# EAGLE design anookum_control (EAGLE 7.3.0)
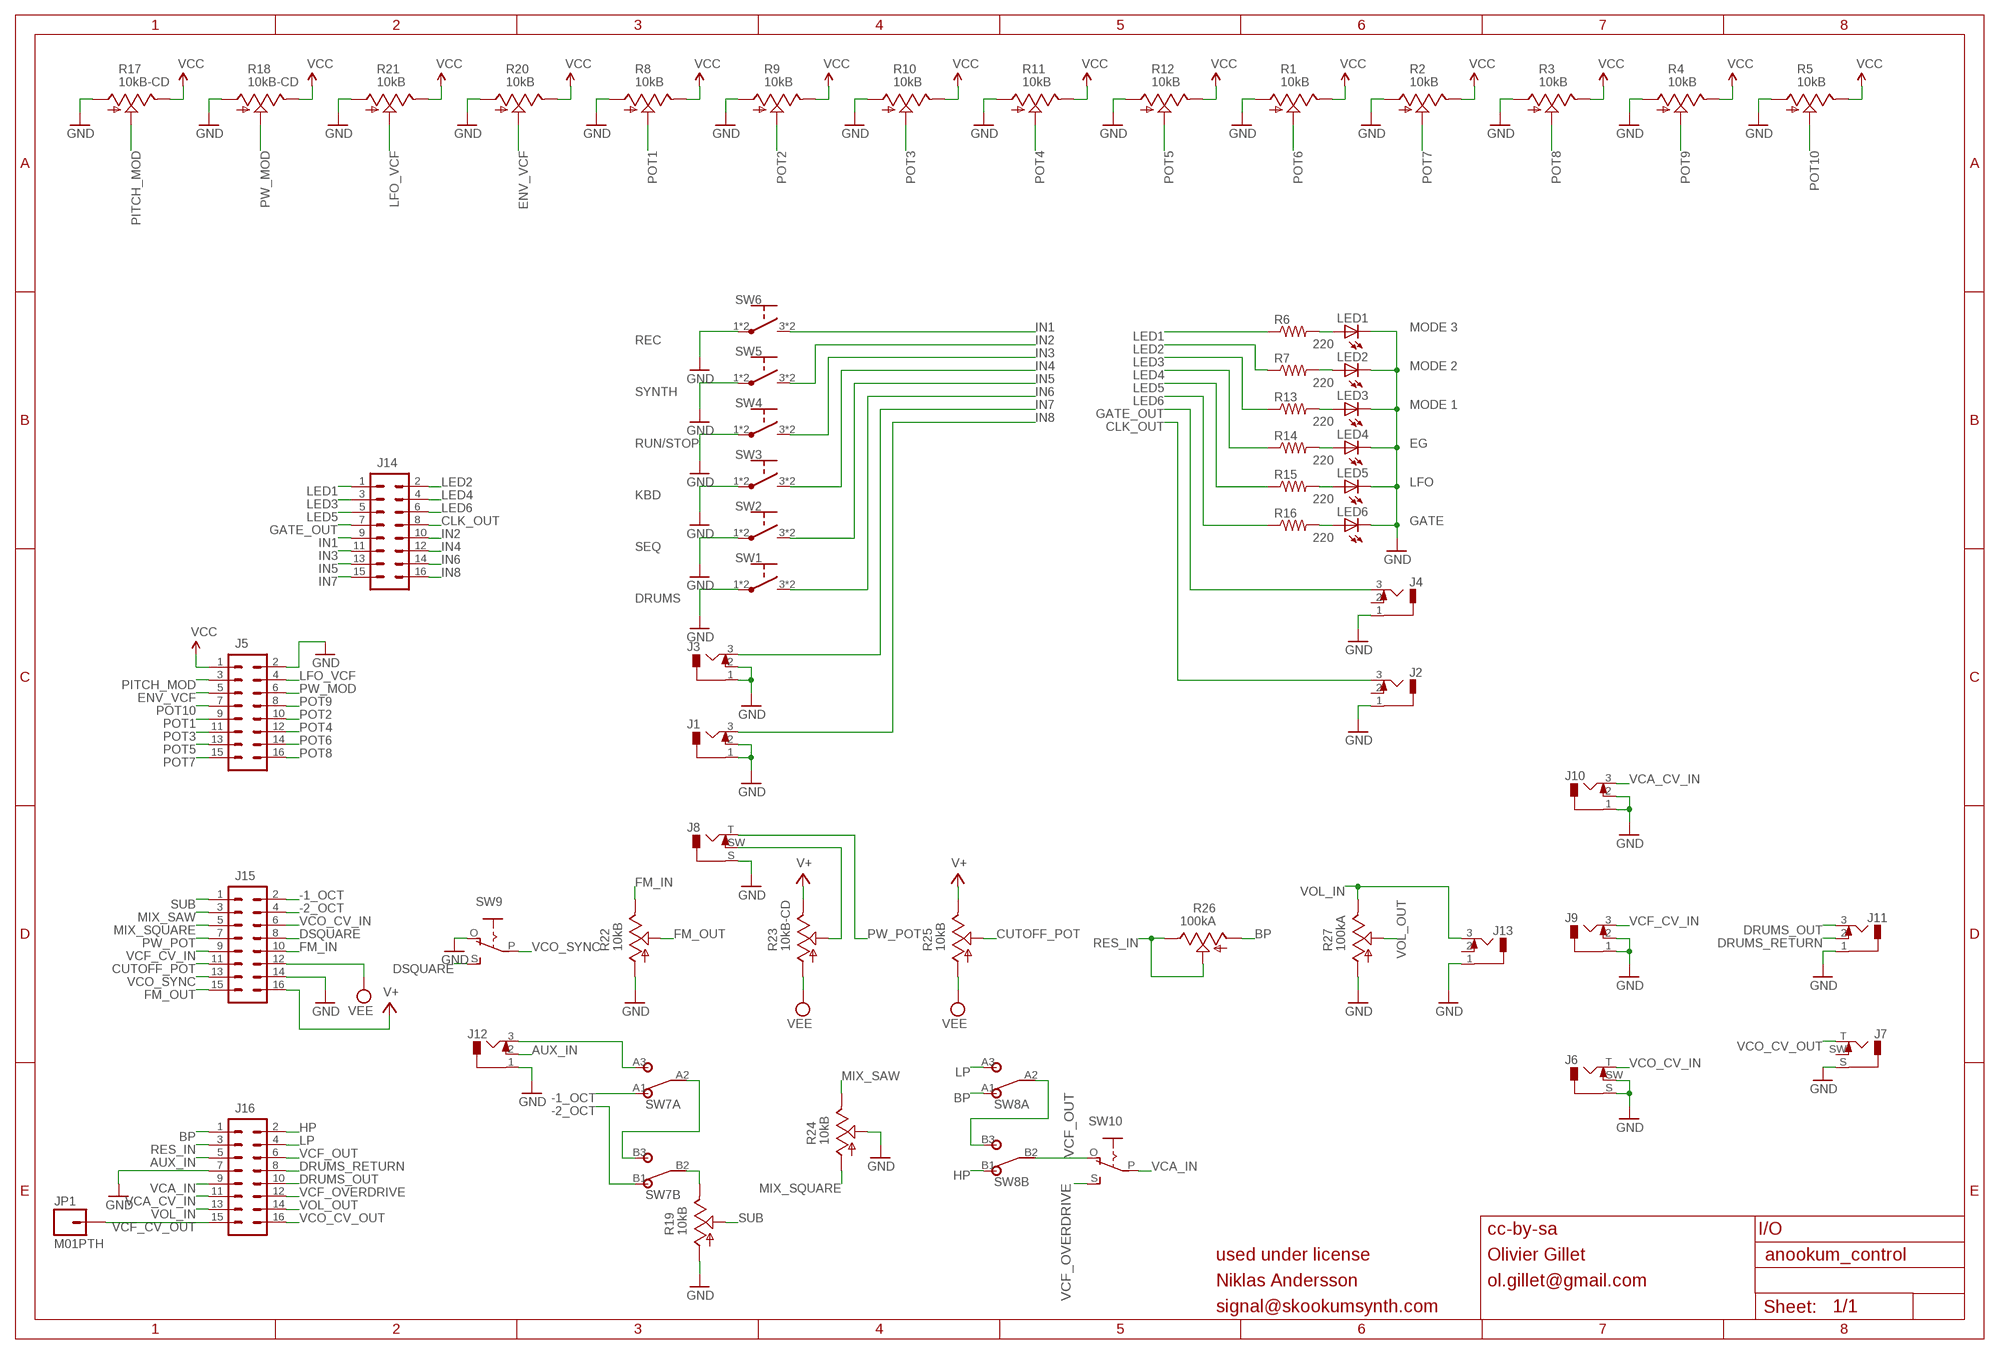
[diagram p0: schematic, sheet 1]

## Parts
J1  JACK_MONO_SW_V  [WQP_PJ301M-12@1]
J2  JACK_MONO_SW_V  [WQP_PJ301M-12@1]
J3  JACK_MONO_SW_V  [WQP_PJ301M-12@1]
J4  JACK_MONO_SW_V  [WQP_PJ301M-12@1]
J5  M08X2  [2X8]
J6  CONN_MONO_SW_F_V  [WQP_PJ301M-12]
J7  CONN_MONO_SW_F_V  [WQP_PJ301M-12]
J8  CONN_MONO_SW_F_V  [WQP_PJ301M-12]
J9  JACK_MONO_SW_V  [WQP_PJ301M-12@1]
J10  JACK_MONO_SW_V  [WQP_PJ301M-12@1]
J11  JACK_MONO_SW_V  [WQP_PJ301M-12@1]
J12  JACK_MONO_SW_V  [WQP_PJ301M-12@1]
J13  JACK_MONO_SW_V  [WQP_PJ301M-12@1]
J14  M08X2  [2X8]
J15  M08X2  [2X8]
J16  M08X2  [2X8]
JP1  M01PTH  [1X01]
LED1  LED3MM  [LED3MM]
LED2  LED3MM  [LED3MM]
LED3  LED3MM  [LED3MM]
LED4  LED3MM  [LED3MM]
LED5  LED3MM  [LED3MM]
LED6  LED3MM  [LED3MM]
R1  10kB  POT_USVERTICAL  [ALPS_POT_VERTICAL]
R2  10kB  POT_USVERTICAL  [ALPS_POT_VERTICAL]
R3  10kB  POT_USVERTICAL  [ALPS_POT_VERTICAL]
R4  10kB  POT_USVERTICAL  [ALPS_POT_VERTICAL]
R5  10kB  POT_USVERTICAL  [ALPS_POT_VERTICAL]
R6  220  R-US_0204/7  [0204/7]
R7  220  R-US_0204/7  [0204/7]
R8  10kB  POT_USVERTICAL  [ALPS_POT_VERTICAL]
R9  10kB  POT_USVERTICAL  [ALPS_POT_VERTICAL]
R10  10kB  POT_USVERTICAL  [ALPS_POT_VERTICAL]
R11  10kB  POT_USVERTICAL  [ALPS_POT_VERTICAL]
R12  10kB  POT_USVERTICAL  [ALPS_POT_VERTICAL]
R13  220  R-US_0204/7  [0204/7]
R14  220  R-US_0204/7  [0204/7]
R15  220  R-US_0204/7  [0204/7]
R16  220  R-US_0204/7  [0204/7]
R17  10kB-CD  POT_USVERTICAL  [ALPS_POT_VERTICAL]
R18  10kB-CD  POT_USVERTICAL  [ALPS_POT_VERTICAL]
R19  10kB  POT_USVERTICAL  [ALPS_POT_VERTICAL]
R20  10kB  POT_USVERTICAL  [ALPS_POT_VERTICAL]
R21  10kB  POT_USVERTICAL  [ALPS_POT_VERTICAL]
R22  10kB  POT_USVERTICAL  [ALPS_POT_VERTICAL]
R23  10kB-CD  POT_USVERTICAL  [ALPS_POT_VERTICAL]
R24  10kB  POT_USVERTICAL  [ALPS_POT_VERTICAL]
R25  10kB  POT_USVERTICAL  [ALPS_POT_VERTICAL]
R26  100kA  POT_USVERTICAL  [ALPS_POT_VERTICAL]
R27  100kA  POT_USVERTICAL  [ALPS_POT_VERTICAL]
SW1  SW_TACTD6  [D6]
SW2  SW_TACTD6  [D6]
SW3  SW_TACTD6  [D6]
SW4  SW_TACTD6  [D6]
SW5  SW_TACTD6  [D6]
SW6  SW_TACTD6  [D6]
SW7  DPDT1AD6T2B4M2RE  [DPDT]
SW8  DPDT1AD6T2B4M2RE  [DPDT]
SW9  EG1218S  [EG1218]
SW10  EG1218S  [EG1218]

## Nets
-1_OCT: J15.2 SW7.A1
-2_OCT: J15.4 SW7.B1
AUX_IN: J12.2(SW) J16.5
BP: J16.1 R26.P$3(A) SW8.A1
CLK_OUT: J2.3(T) J14.8
CUTOFF_POT: J15.11 R25.P$2(S)
DRUMS_OUT: J11.3(T) J16.10
DRUMS_RETURN: J11.2(SW) J16.8
DSQUARE: J15.8 SW9.S
ENV_VCF: J5.5 R20.P$2(S)
FM_IN: J15.10 R22.P$1(E)
FM_OUT: J15.15 R22.P$2(S)
GATE_OUT: J4.3(T) J14.7
GND: J1.1(S) J1.2(SW) J2.1(S) J3.1(S) J3.2(SW) J4.1(S) J5.2 J6.S J6.SW J7.S J8.S J9.1(S) J9.2(SW) J10.1(S) J10.2(SW) J11.1(S) J12.1(S) J13.1(S) J15.14 J16.7 LED1.K(C) LED2.K(C) LED3.K(C) LED4.K(C) LED5.K(C) LED6.K(C) R1.P$3(A) R2.P$3(A) R3.P$3(A) R4.P$3(A) R5.P$3(A) R8.P$3(A) R9.P$3(A) R10.P$3(A) R11.P$3(A) R12.P$3(A) R17.P$3(A) R18.P$3(A) R19.P$3(A) R20.P$3(A) R21.P$3(A) R22.P$3(A) R24.P$2(S) R27.P$3(A) SW1.1 SW1.2 SW2.1 SW2.2 SW3.1 SW3.2 SW4.1 SW4.2 SW5.1 SW5.2 SW6.1 SW6.2 SW9.O
HP: J16.2 SW8.B1
IN1: J14.9 SW6.3 SW6.4
IN2: J14.10 SW5.3 SW5.4
IN3: J14.11 SW4.3 SW4.4
IN4: J14.12 SW3.3 SW3.4
IN5: J14.13 SW2.3 SW2.4
IN6: J14.14 SW1.3 SW1.4
IN7: J3.3(T) J14.15
IN8: J1.3(T) J14.16
LED1: J14.1 R6.1
LED2: J14.2 R7.1
LED3: J14.3 R13.1
LED4: J14.4 R14.1
LED5: J14.5 R15.1
LED6: J14.6 R16.1
LFO_VCF: J5.4 R21.P$2(S)
LP: J16.4 SW8.A3
MIX_SAW: J15.3 R24.P$1(E)
MIX_SQUARE: J15.5 R24.P$3(A)
N$1: J8.SW R23.P$2(S)
N$2: R19.P$1(E) SW7.B2
N$10: J12.3(T) SW7.A3
N$36: SW8.A2 SW8.B3
N$42: LED1.A R6.2
N$43: LED2.A R7.2
N$44: LED3.A R13.2
N$45: LED4.A R14.2
N$46: LED5.A R15.2
N$47: LED6.A R16.2
N$65: SW7.A2 SW7.B3
PITCH_MOD: J5.3 R17.P$2(S)
POT1: J5.9 R8.P$2(S)
POT2: J5.10 R9.P$2(S)
POT3: J5.11 R10.P$2(S)
POT4: J5.12 R11.P$2(S)
POT5: J5.13 R12.P$2(S)
POT6: J5.14 R1.P$2(S)
POT7: J5.15 R2.P$2(S)
POT8: J5.16 R3.P$2(S)
POT9: J5.8 R4.P$2(S)
POT10: J5.7 R5.P$2(S)
PW_MOD: J5.6 R18.P$2(S)
PW_POT: J8.T J15.7
RES_IN: J16.3 R26.P$1(E) R26.P$2(S)
SUB: J15.1 R19.P$2(S)
V+: J15.16 R23.P$1(E) R25.P$1(E)
VCA_CV_IN: J10.3(T) J16.11
VCA_IN: J16.9 SW10.P
VCC: J5.1 R1.P$1(E) R2.P$1(E) R3.P$1(E) R4.P$1(E) R5.P$1(E) R8.P$1(E) R9.P$1(E) R10.P$1(E) R11.P$1(E) R12.P$1(E) R17.P$1(E) R18.P$1(E) R20.P$1(E) R21.P$1(E)
VCF_CV_IN: J9.3(T) J15.9
VCF_CV_OUT: J16.15 JP1.1
VCF_OUT: J16.6 SW8.B2 SW10.O
VCF_OVERDRIVE: J16.12 SW10.S
VCO_CV_IN: J6.T J15.6
VCO_CV_OUT: J7.T J16.16
VCO_SYNC: J15.13 SW9.P
VEE: J15.12 R23.P$3(A) R25.P$3(A)
VOL_IN: J13.3(T) J16.13 R27.P$1(E)
VOL_OUT: J16.14 R27.P$2(S)
Unconnected: J2.2(SW) J4.2(SW) J7.SW J13.2(SW)

## Notes on the sheet
- MODE 3
- REC
- MODE 2
- SYNTH
- MODE 1
- RUN/STOP | EG
- LFO
- KBD
- GATE
- SEQ
- DRUMS
- cc-by-sa | I/O
- used under license | Olivier Gillet
- Niklas Andersson | ol.gillet@gmail.com
- signal@skookumsynth.com

## Library data of the parts
J1-J4 J9-J13 = 000:JACK_MONO_SW: 3.5mm mono switched jacks WQP-PJ301M-12 - Available at: http://erthenvar.com and http://www.thonk.co.uk/
J5 J14-J16 = SparkFun:M08X2
J6-J8 = 000:CONN_MONO_SW_F: 3.5mm mono switched jacks WQP-PJ301M-12 - Available at: http://erthenvar.com and http://www.thonk.co.uk/
JP1 = SparkFun:M01: Header 1 Standard 1-pin 0.1" header. Use with straight break away headers (SKU : PRT-00116), right angle break away headers (PRT-00553), swiss pins (PRT-00743), machine pins (PRT-00117), and female headers (PRT-00115).
LED1-LED6 = led:LED: LED OSRAM: - CHIPLED LG R971, LG N971, LY N971, LG Q971, LY Q971, LO R971, LY R971 LH N974, LH R974 LS Q976, LO Q976, LY Q976 LO Q996 - Hyper CHIPLED LW Q18S LB Q993, LB Q99A, LB R99A - SideLED LS A670, LO A670, LY A670, LG A670, LP A670 LB A673, LV A673, LT A673, LW A673 LH A674 LY A675 LS A676, LA A676, LO A676, LY A676, LW A676 LS A679, LY A679, LG A679 - Hyper Micro SIDELED® LS Y876, LA Y876, LO Y876, LY Y876 LT Y87S - SmartLED LW L88C, LW L88S LB L89C, LB L89S, LG L890 LS L89K, LO L89K, LY L89K LS L896, LA L896, LO L896, LY L896 - TOPLED LS T670, LO T670, LY T670, LG T670, LP T670 LSG T670, LSP T670, LSY T670, LOP T670, LYG T670 LG T671, LOG T671, LSG T671 LB T673, LV T673, LT T673, LW T673 LH T674 LS T676, LA T676, LO T676, LY T676, LB T676, LH T676, LSB T676, LW T676 LB T67C, LV T67C, LT T67C, LS T67K, LO T67K, LY T67K, LW E67C LS E67B, LA E67B, LO E67B, LY E67B, LB E67C, LV E67C, LT E67C LW T67C LS T679, LY T679, LG T679 LS T770, LO T770, LY T770, LG T770, LP T770 LB T773, LV T773, LT T773, LW T773 LH T774 LS E675, LA E675, LY E675, LS T675 LS T776, LA T776, LO T776, LY T776, LB T776 LHGB T686 LT T68C, LB T68C - Hyper Mini TOPLED® LB M676 - Mini TOPLED Santana® LG M470 LS M47K, LO M47K, LY M47K Source: http://www.osram.convergy.de LUXEON: - LUMILED® LXK2-PW12-R00, LXK2-PW12-S00, LXK2-PW14-U00, LXK2-PW14-V00 LXK2-PM12-R00, LXK2-PM12-S00, LXK2-PM14-U00 LXK2-PE12-Q00, LXK2-PE12-R00, LXK2-PE12-S00, LXK2-PE14-T00, LXK2-PE14-U00 LXK2-PB12-K00, LXK2-PB12-L00, LXK2-PB12-M00, LXK2-PB14-N00, LXK2-PB14-P00, LXK2-PB14-Q00 LXK2-PR12-L00, LXK2-PR12-M00, LXK2-PR14-Q00, LXK2-PR14-R00 LXK2-PD12-Q00, LXK2-PD12-R00, LXK2-PD12-S00 LXK2-PH12-R00, LXK2-PH12-S00 LXK2-PL12-P00, LXK2-PL12-Q00, LXK2-PL12-R00 Source: www.luxeon.com KINGBRIGHT: KA-3528ASYC Source: www.kingbright.com
R1-R5 R8-R12 R17-R27 = pot-alps:POT_US
R6 R7 R13-R16 = rcl:R-US_: RESISTOR, American symbol
SW1-SW6 = 000:SW_TACT
SW7 SW8 = Anu-Control-revC:DPDT
SW9 SW10 = Anu-Control-revC:EG1218: SLIDING SWITCH 0.1" spacing through hole, vertical SPDT slide switch http://www.ladyada.net/library/pcb/eaglelibrary.html

## Board
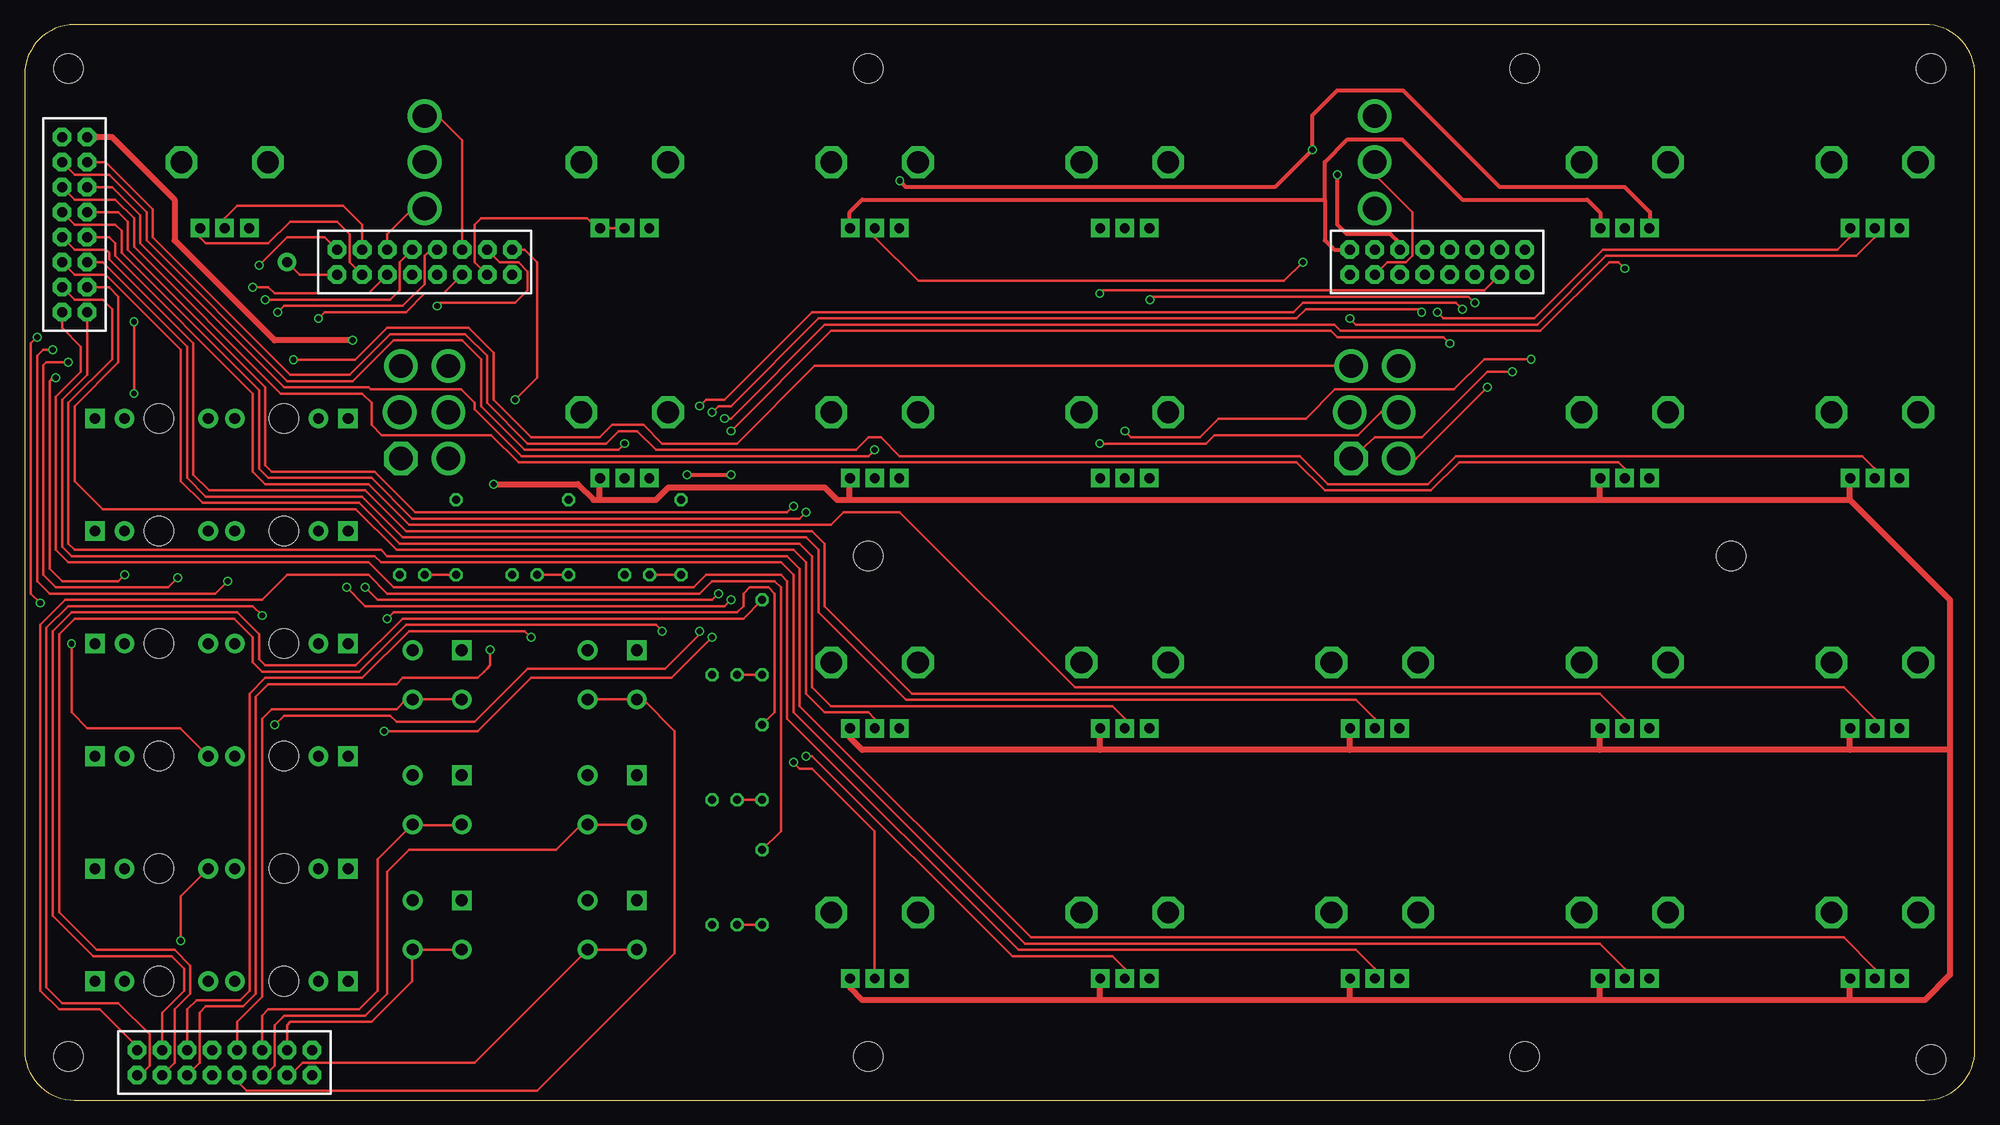
[diagram p1: board, top side]
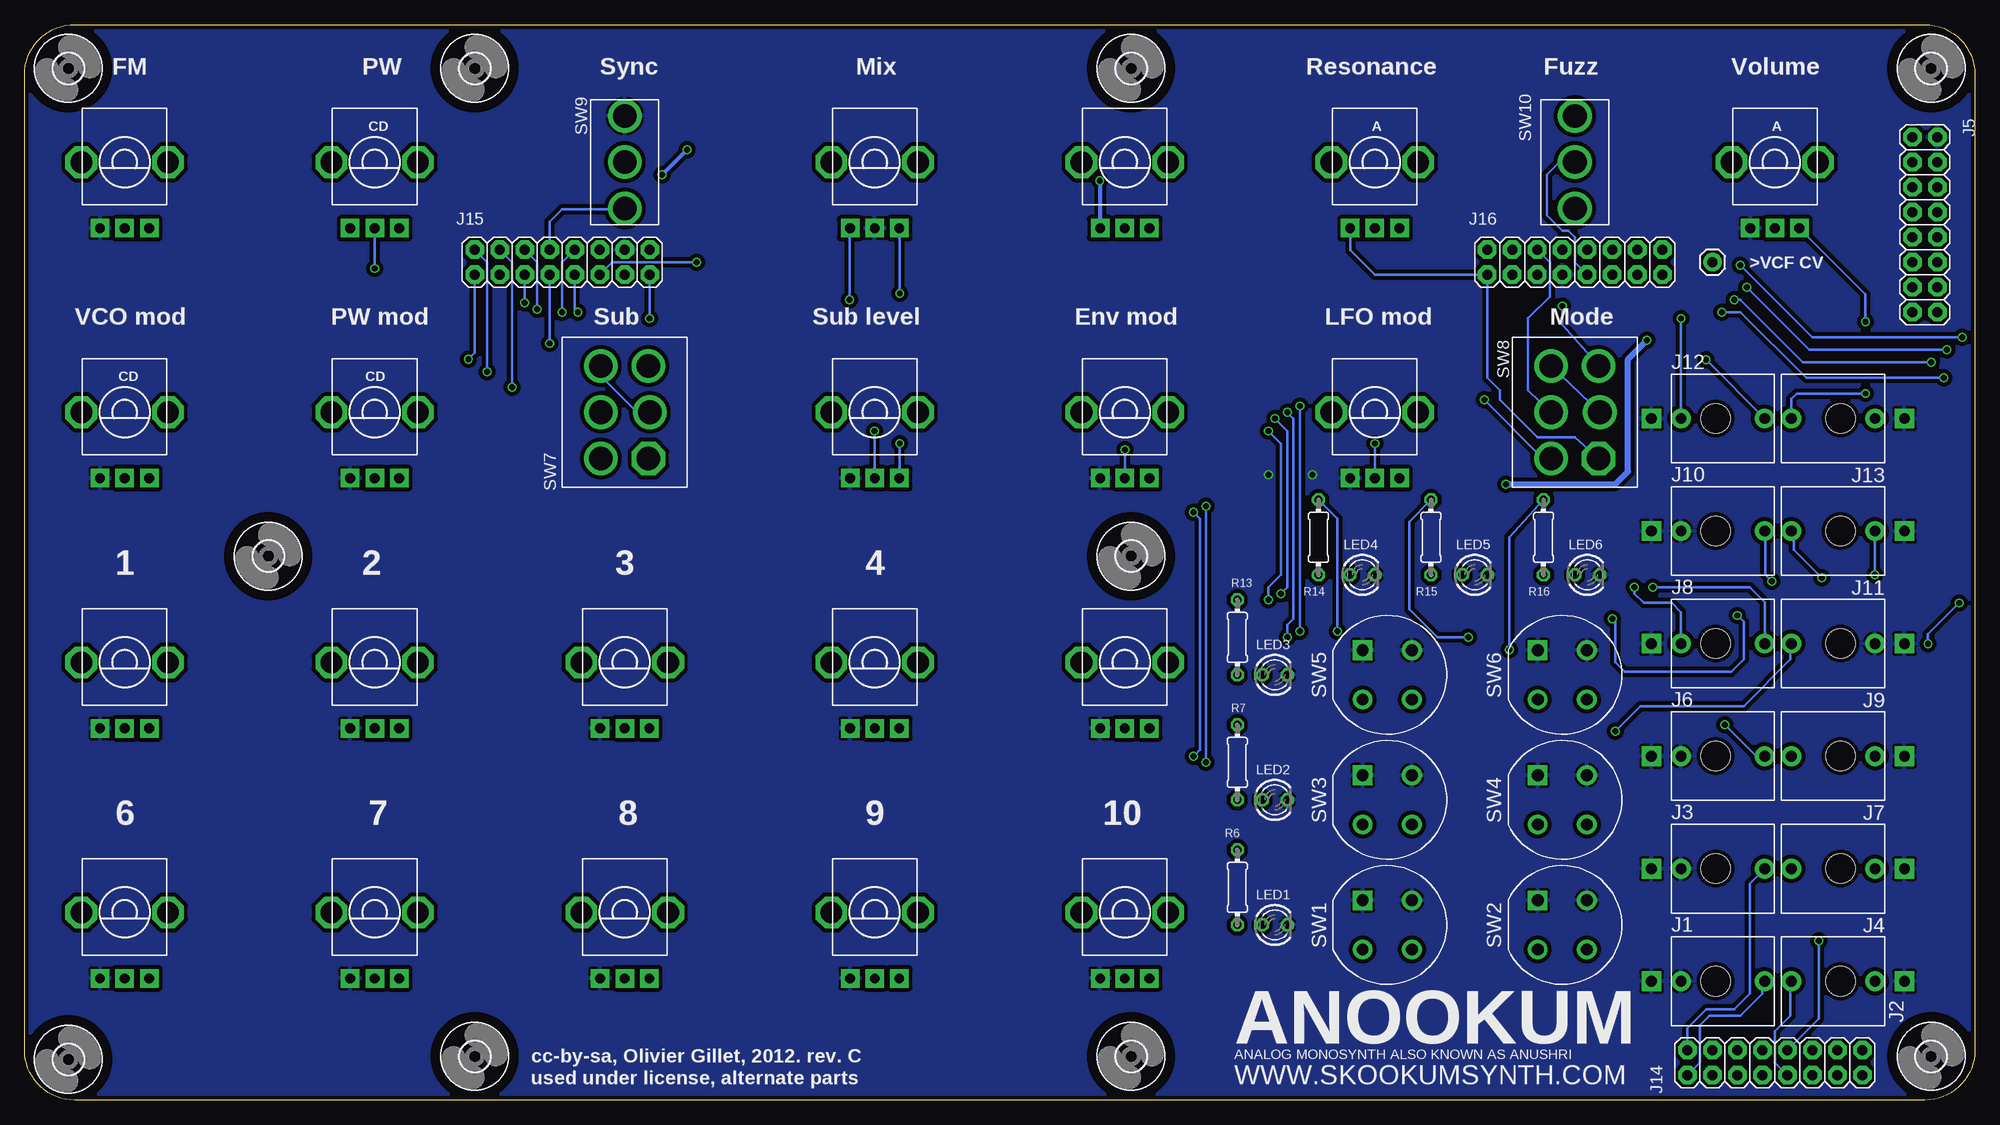
[diagram p2: board, bottom side, seen from below]

Size 198.12 x 109.22 mm. Coordinates in mm from the lower left corner, seen from the top.
Outline: 5.08,109.22 arc90 0,104.14 0,5.08 arc90 5.08,0 193.04,0 arc90 198.12,5.08 198.12,104.14 arc90 193.04,109.22 5.08,109.22
Copper layers (1*16): Top 0.035mm / dielectric 1.5mm / Bottom 0.035mm
Design rules "dirt_cheap_dirty_boards.v1": minimum track width 5mil, minimum drill 12mil, track to track 5mil, track to pad 5mil, pad to pad 5mil, via to via 5mil, smd to smd 0mil, copper to edge 10mil, drill to drill 10mil, minimum pad ring 10mil, minimum via ring 6mil, stop-mask expansion 2mil, vias tented up to drill 25mil, thermal gap 10mil

### Footprints (pad centres in the part's own frame; a part is rotated, then mirrored left to right if it is on the bottom)
WQP_PJ301M-12@1 = drill 1.1 pad 2 square: 1 0,-6.5 | drill 1.1 pad 2: 2 0,-3.5; 3 0,5 | hole 3: 0,0
2X8 = drill 1.016 pad 1.88 octagon: 1 0,0; 2 0,2.54; 3 2.54,0; 4 2.54,2.54; 5 5.08,0; 6 5.08,2.54; 7 7.62,0; 8 7.62,2.54; 9 10.16,0; 10 10.16,2.54; 11 12.7,0; 12 12.7,2.54; 13 15.24,0; 14 15.24,2.54; 15 17.78,0; 16 17.78,2.54
WQP_PJ301M-12 = drill 1.1 pad 2 square: S 0,-6.5 | drill 1.1 pad 2: SW 0,-3.5; T 0,5 | hole 3: 0,0
1X01 = drill 1.016 pad 1.88: 1 0,0
LED3MM = drill 0.813 octagon: A -1.27,0; K 1.27,0
ALPS_POT_VERTICAL = drill 1 pad 1.88 square: P$1 -2.5,6.7; P$2 0,6.7; P$3 2.5,6.7 | drill 2.2 pad 3.175 octagon: P$4 -4.4,0; P$5 4.4,0
0204/7 = drill 0.813 octagon: 1 -3.81,0; 2 3.81,0
D6 = drill 1.2 pad 2 square: 1 -2.5,2.5 | drill 1.2 pad 2: 2 2.5,2.5; 3 -2.5,-2.5; 4 2.5,-2.5
DPDT = drill 2.4 octagon: A1 -2.415,4.7 | drill 2.4: A2 -2.54,0; A3 -2.415,-4.7; B1 2.415,4.7; B2 2.415,0; B3 2.415,-4.7
EG1218 = drill 2.4: O -4.7,0; P 0,0; S 4.7,0
3,0 = hole 3: 0,0

### Placement (x,y rotation side)
J1  26.35,12.06 270 bottom
J2  13.65,12.06 90 bottom
J3  26.35,23.5 270 bottom
J4  13.65,23.5 90 bottom
J5  6.35,97.79 270 bottom
J6  26.35,34.92 270 bottom
J7  13.65,34.92 90 bottom
J8  26.35,46.35 270 bottom
J9  13.65,46.35 90 bottom
J10  26.35,57.78 270 bottom
J11  13.65,57.78 90 bottom
J12  26.35,69.22 270 bottom
J13  13.65,69.22 90 bottom
J14  11.43,5.08 180 bottom
J15  152.4,83.82 0 bottom
J16  49.53,83.82 0 bottom
JP1  26.67,85.09 0 bottom
LED1  71.12,17.78 0 bottom
LED2  71.12,30.48 0 bottom
LED3  71.12,43.18 0 bottom
LED4  62.23,53.34 0 bottom
LED5  50.8,53.34 0 bottom
LED6  39.37,53.34 0 bottom
R1  187.96,19.05 180 bottom
R2  162.56,19.05 180 bottom
R3  137.16,19.05 180 bottom
R4  111.76,19.05 180 bottom
R5  86.36,19.05 180 bottom
R6  74.93,21.59 270 bottom
R7  74.93,34.29 270 bottom
R8  187.96,44.45 180 bottom
R9  162.56,44.45 180 bottom
R10  137.16,44.45 180 bottom
R11  111.76,44.45 180 bottom
R12  86.36,44.45 180 bottom
R13  74.93,46.99 270 bottom
R14  66.67,57.15 270 bottom
R15  55.24,57.15 270 bottom
R16  43.81,57.15 270 bottom
R17  187.96,69.85 180 bottom
R18  162.56,69.85 180 bottom
R19  111.76,69.85 180 bottom
R20  86.36,69.85 180 bottom
R21  60.96,69.85 180 bottom
R22  187.96,95.25 180 bottom
R23  162.56,95.25 180 bottom
R24  111.76,95.25 180 bottom
R25  86.36,95.25 180 bottom
R26  60.96,95.25 180 bottom
R27  20.32,95.25 180 bottom
SW1  59.69,17.78 0 bottom
SW2  41.91,17.78 0 bottom
SW3  59.69,30.48 0 bottom
SW4  41.91,30.48 0 bottom
SW5  59.69,43.18 0 bottom
SW6  41.91,43.18 0 bottom
SW7  137.16,69.85 180 bottom
SW8  40.64,69.85 180 bottom
SW9  137.16,95.25 270 bottom
SW10  40.64,95.25 270 bottom
U$1  [3,0]  193.68,4.13 0 bottom
U$2  [3,0]  152.4,4.45 0 bottom
U$3  [3,0]  85.72,4.45 0 bottom
U$4  [3,0]  4.45,4.45 0 bottom
U$6  [3,0]  173.35,55.24 0 bottom
U$7  [3,0]  85.72,55.24 0 bottom
U$8  [3,0]  193.68,104.78 0 bottom
U$9  [3,0]  152.4,104.78 0 bottom
U$10  [3,0]  85.72,104.78 0 bottom
U$11  [3,0]  4.45,104.78 0 bottom

### Tracks (layer width: path | path; a pad name or v marks a point on that pad's centre or on a via)
-1_OCT  (via drill 0.6)
  Top 0.254: v151.13,73.98 148.59,73.98 141.92,67.31 137.16,67.31 SW7.A1
  Bottom 0.254: v151.13,73.98 151.13,85.09 J15.2
-2_OCT  (via drill 0.6)
  Top 0.254: v148.59,72.39 141.35,65.15 SW7.B1
  Bottom 0.254: v148.59,72.39 148.59,85.09 J15.4
AUX_IN  (via drill 0.6)
  Top 0.254: v29.84,79.38 30.48,80.01 38.73,80.01 40.64,81.92 42.55,81.92 J16.5
  Bottom 0.254: J12.2 29.85,79.37 v29.84,79.38
BP
  Bottom 0.254: R26.P$3 63.46,86.32 60.96,83.82 J16.1 49.53,73.34 48.26,72.07 48.26,71.12 44.45,67.31 40.64,67.31 SW8.A1
CLK_OUT
  Bottom 0.254: J14.8 20.32,3.81 20.32,6.99 18.73,8.57 18.73,11.98 J2.3
CUTOFF_POT  (via drill 0.6)
  Top 0.254: R25.P$2 86.36,87.63 90.81,83.19 127.95,83.19 v129.86,85.09
  Bottom 0.254: v129.86,85.09 138.43,85.09 J15.11
DRUMS_OUT  (via drill 0.6)
  Top 0.254: J16.10 38.1,85.09 38.1,82.23 37.15,81.28 v24.45,81.28 | v15.56,53.02 14.61,52.07 3.17,52.07 1.91,53.34 1.91,74.61 2.22,74.93 v4.45,74.93
  Bottom 0.254: v15.56,53.02 18.41,55.88 18.41,57.55 J11.3 | v4.45,74.93 17.46,74.93 23.81,81.28 v24.45,81.28
DRUMS_RETURN  (via drill 0.6)
  Top 0.254: v10.16,53.34 9.53,52.7 3.81,52.7 2.54,53.98 2.54,73.03 2.86,73.34 v3.17,73.34 | J16.8 41.91,87 40.64,85.72 40.64,82.87 38.42,80.64 26.35,80.64 v25.72,80.01
  Bottom 0.254: J11.2 v10.15,53.35 v10.16,53.34 | v3.17,73.34 17.14,73.34 23.81,80.01 v25.72,80.01
DSQUARE
  Bottom 0.254: J15.8 144.78,89.22 143.51,90.49 137.22,90.49 SW9.S
ENV_VCF  (via drill 0.6)
  Top 0.254: v86.36,66.04 85.72,65.41 50.48,65.41 45.72,70.17 45.72,70.8 44.35,72.17 35.14,72.17 34.92,72.39 26.35,72.39 11.75,87 11.75,89.85 8.89,92.71 J5.5
  Bottom 0.254: v86.36,66.04 R20.P$2
FM_IN  (via drill 0.6)
  Top 0.254: R22.P$1 185.42,88.51 185.42,87.63 184.15,86.36 160.34,86.36 153.35,79.38 144.15,79.38 v143.51,80.01
  Bottom 0.254: v143.51,80.01 143.51,85.09 J15.10
FM_OUT  (via drill 0.6)
  Top 0.254: R22.P$2 187.96,87.63 186.06,85.72 160.66,85.72 153.67,78.74 135.25,78.74 v134.62,79.38
  Bottom 0.254: v134.62,79.38 J15.15
GATE_OUT  (via drill 0.6)
  Top 0.254: v15.88,16.19 15.88,20.72 J4.3
  Bottom 0.254: J14.7 15.88,8.26 v15.88,16.19
GND  (via drill 0.6)
  Top 0.406: v67.31,63.5 v71.75,63.5
  pour Bottom (isolate 0.406): 193.04,0 arc90 198.12,5.08 198.12,104.14 arc90 193.04,109.22 5.08,109.22 arc90 0,104.14 0,5.08 arc90 5.08,0
HP  (via drill 0.6)
  Top 0.254: J16.2 50.8,86.36 52.07,85.09 52.07,73.34 v49.85,71.12
  Bottom 0.254: SW8.B1 43.81,65.09 v49.85,71.12
IN1
  Top 0.254: J14.9 21.59,7.94 24.13,10.48 24.13,38.73 25.08,39.69 37.78,39.69 38.77,40.68 SW6.4 SW6.3
IN2
  Top 0.254: J14.10 21.59,1.91 22.54,0.95 52.07,0.95 66.04,14.92 66.04,37.47 62.87,40.64 62.23,40.64 SW5.3 SW5.4 62.14,40.68
  Bottom 0.254: 62.14,40.68 SW5.3
IN3
  Top 0.254: J14.11 24.13,8.57 24.77,9.21 33.97,9.21 35.88,11.11 35.88,24.45 39.37,27.94 39.37,27.89 | 39.37,27.89 SW4.4 | 39.37,27.89 43.81,27.89 SW4.3
IN4
  Top 0.254: J14.12 24.45,2.54 25.4,3.49 25.4,7.62 26.19,8.41 26.35,8.57 34.61,8.57 36.83,10.79 36.83,23.18 39.05,25.4 53.98,25.4 56.55,27.98 SW3.4 SW3.3
IN5
  Top 0.254: J14.13 26.67,7.62 26.99,7.94 35.24,7.94 39.37,12.06 39.37,15.24 SW2.4 SW2.3
IN6
  Top 0.254: 26.67,2.22 J14.14 26.99,2.54 28.26,3.81 45.72,3.81 SW1.4 SW1.3
IN7
  Bottom 0.254: J14.15 29.21,7.3 27.3,9.21 24.45,9.21 22.86,10.79 22.86,21.99 J3.3
IN8
  Bottom 0.254: J14.16 27.94,3.81 27.94,7.62 26.99,8.57 23.81,8.57 21.59,10.79 21.59,11.83 J1.3
LED1
  Top 0.254: R6.1 76.83,27.3 76.83,52.07 76.2,52.7 69.85,52.7 68.58,51.44 36.83,51.44 34.92,53.34 26.67,53.34 24.13,50.8 4.13,50.8 1.59,48.26 1.59,11.11 3.49,9.21 7.62,9.21 11.11,5.71 11.11,5.4 J14.1
LED2  (via drill 0.6)
  Top 0.254: R7.1 76.2,39.37 76.2,51.44 75.56,52.07 73.66,52.07 73.03,51.44 73.03,50.16 72.39,49.53 37.47,49.53 v36.83,48.9 | J14.2 11.75,2.54 12.7,3.49 12.7,6.67 9.53,9.84 3.81,9.84 2.22,11.43 2.22,47.94 4.45,50.16 23.18,50.16 v24.13,49.21
  Bottom 0.254: v24.13,49.21 23.5,48.58 23.5,44.77 24.77,43.5 35.56,43.5 36.51,44.45 36.51,48.58 v36.83,48.9
LED3
  Top 0.254: R13.1 73.03,48.9 38.42,48.9 33.66,44.13 24.45,44.13 23.81,44.77 23.81,47.31 21.59,49.53 4.76,49.53 2.86,47.62 2.86,18.73 6.99,14.61 14.92,14.61 16.19,13.34 16.19,11.11 13.97,8.89 J14.3
LED4  (via drill 0.6)
  Top 0.254: v64.77,47.62 64.14,48.26 38.73,48.26 33.97,43.5 24.13,43.5 23.18,44.45 23.18,46.99 21.27,48.9 5.08,48.9 3.49,47.31 3.49,19.05 7.3,15.24 15.24,15.24 16.83,13.65 16.83,10.79 15.24,9.21 15.24,3.81 J14.4
  Bottom 0.254: v64.77,47.62 64.77,59.05 R14.1
LED5  (via drill 0.6)
  Top 0.254: v51.44,46.99 50.8,47.62 39.05,47.62 34.29,42.86 24.45,42.86 22.86,41.27 22.86,11.11 21.91,10.16 17.46,10.16 16.51,9.21 J14.5
  Bottom 0.254: R15.1 57.47,58.74 57.47,49.85 54.61,46.99 v51.44,46.99
LED6  (via drill 0.6)
  Top 0.254: J14.6 17.78,3.81 17.78,8.89 18.41,9.53 22.23,9.53 23.5,10.79 23.5,40.96 24.77,42.23 37.78,42.23 38.42,42.86 46.04,42.86 46.67,43.5 46.99,43.81 47.31,44.13 v47.31,45.72
  Bottom 0.254: v47.31,45.72 47.31,57.15 R16.1
LFO_VCF  (via drill 0.6)
  Top 0.254: v60.96,66.67 60.33,66.04 50.8,66.04 46.35,70.48 46.35,75.25 44.45,77.15 37.47,77.15 33.34,73.03 26.67,73.03 12.38,87.31 12.38,90.17 8.57,93.98 5.08,93.98 J5.4
  Bottom 0.254: v60.96,66.67 R21.P$2
LP  (via drill 0.6)
  Top 0.254: J16.4 48.26,85.09 50.16,85.09 51.12,84.14 51.12,82.23 49.85,80.96 42.23,80.96 v41.91,80.64
  Bottom 0.254: SW8.A3 41.91,78.74 v41.91,80.64
MIX_SAW  (via drill 0.6)
  Top 0.254: v109.22,81.92 109.54,82.23 148.27,82.23 J15.3
  Bottom 0.254: R24.P$1 109.22,88.51 v109.22,81.92
MIX_SQUARE  (via drill 0.6)
  Top 0.254: v114.3,81.28 114.62,81.6 146.69,81.6 v147.32,80.96
  Bottom 0.254: R24.P$3 114.3,88.51 v114.3,81.28 | v147.32,80.96 J15.5
N$1  (via drill 0.6)
  Top 0.254: v34.61,52.07 35.88,50.8 69.85,50.8 v70.48,51.44 | v71.12,69.22 71.75,69.22 81.28,78.74 133.03,78.74 133.67,78.11 153.99,78.11 160.97,85.09 161.93,85.09 v162.56,84.45
  Bottom 0.254: v70.48,51.44 69.85,52.07 69.85,67.94 v71.12,69.22 | v162.56,84.45 R23.P$2 | J8.SW 29.85,49.54 30.8,50.48 33.66,50.48 34.61,51.44 v34.61,52.07
N$2  (via drill 0.6)
  Top 0.254: SW7.B2 137.79,69.85 135.46,67.51 120.85,67.51 120.02,66.67 v109.22,66.67
  Bottom 0.254: R19.P$1 109.22,63.15 v109.22,66.67
N$10  (via drill 0.6)
  Top 0.254: v27.3,75.17 33.58,75.17 36.83,78.42 45.09,78.42 47.62,75.88 47.62,71.12 51.44,67.31 58.42,67.31 59.69,68.58 62.87,68.58 64.77,66.67 72.39,66.67 80.27,74.55 SW7.A3
  Bottom 0.254: 27.3,75.25 v27.3,75.17 J12.3
N$36
  Bottom 0.254: SW8.A2 SW8.B3
N$42
  Top 0.254: LED1.A R6.2
N$43
  Top 0.254: LED2.A R7.2
N$44
  Top 0.254: LED3.A R13.2
N$45
  Top 0.254: LED4.A R14.2
N$46
  Top 0.254: LED5.A R15.2
N$47
  Top 0.254: LED6.A R16.2
N$65
  Bottom 0.254: SW7.A2 135.89,69.85 139.7,73.66 SW7.B3
PITCH_MOD
  Top 0.254: R17.P$2 187.96,64.14 186.69,65.41 145.41,65.41 142.56,62.55 132.4,62.55 129.54,65.41 88.9,65.41 87,67.31 85.72,67.31 84.45,66.04 64.14,66.04 62.23,67.94 60.33,67.94 59.05,66.67 51.12,66.67 46.99,70.8 46.99,75.56 44.77,77.79 37.15,77.79 33.02,73.66 26.99,73.66 13.02,87.63 13.02,90.49 8.26,95.25 J5.3
POT1
  Top 0.254: R8.P$2 187.96,38.73 184.78,41.91 106.68,41.91 88.9,59.69 83.19,59.69 81.92,58.42 39.05,58.42 34.92,62.55 24.45,62.55 23.18,63.82 23.18,71.75 9.21,85.72 9.21,87 8.57,87.63 J5.9
POT2
  Top 0.254: R9.P$2 162.56,38.73 160.02,41.27 90.17,41.27 81.28,50.16 81.28,56.52 80.01,57.78 38.73,57.78 34.61,61.91 18.73,61.91 17.14,63.5 17.14,76.83 8.57,85.41 8.57,86.04 8.26,86.36 5.08,86.36 J5.10
POT3
  Top 0.254: R10.P$2 137.16,38.73 135.25,40.64 89.53,40.64 80.64,49.53 80.64,55.88 79.38,57.15 38.42,57.15 34.29,61.28 18.41,61.28 16.51,63.18 16.51,76.52 7.94,85.09 J5.11
POT4
  Top 0.254: R11.P$2 111.76,38.73 110.49,40.01 81.92,40.01 80.01,41.91 80.01,55.24 78.74,56.52 38.1,56.52 33.97,60.64 18.1,60.64 15.88,62.87 15.88,76.2 8.26,83.82 5.08,83.82 J5.12
POT5
  Top 0.254: R12.P$2 86.36,38.73 85.72,39.37 81.28,39.37 79.38,41.27 79.38,54.61 78.11,55.88 37.78,55.88 33.66,60.01 7.94,60.01 5.08,62.87 5.08,70.48 9.53,74.93 9.53,81.6 8.57,82.55 J5.13
POT6
  Top 0.254: R1.P$2 187.96,13.34 184.78,16.51 102.23,16.51 78.74,40.01 78.74,53.98 77.47,55.24 36.83,55.24 36.2,55.88 5.08,55.88 4.45,56.52 4.45,70.8 8.89,75.25 8.89,80.33 7.94,81.28 5.08,81.28 J5.14
POT7
  Top 0.254: R2.P$2 162.56,13.34 160.02,15.88 101.6,15.88 78.11,39.37 78.11,53.34 76.83,54.61 36.2,54.61 35.56,55.24 4.76,55.24 3.81,56.2 3.81,71.12 6.35,73.66 J5.15
POT8
  Top 0.254: R3.P$2 137.16,13.34 135.25,15.24 100.97,15.24 77.47,38.73 77.47,52.7 76.83,53.34 69.22,53.34 67.94,52.07 37.47,52.07 34.92,54.61 4.45,54.61 3.17,55.88 3.17,71.44 5.71,73.98 5.71,76.52 3.81,78.42 J5.16
POT9  (via drill 0.6)
  Top 0.254: R4.P$2 111.76,13.34 110.49,14.61 100.33,14.61 80.01,34.92 v79.38,34.92 | v79.38,59.69 78.74,59.05 39.37,59.05 35.24,63.18 24.77,63.18 23.81,64.14 23.81,72.07 9.84,86.04 9.84,88.27 9.21,88.9 5.08,88.9 J5.8
  Bottom 0.254: v79.38,59.69 78.74,59.05 78.74,35.56 v79.38,34.92
POT10  (via drill 0.6)
  Top 0.254: R5.P$2 86.36,27.3 80.01,33.66 78.74,33.66 v78.11,34.29 | v78.11,60.33 77.47,59.69 39.69,59.69 35.56,63.82 25.08,63.82 24.45,64.45 24.45,72.39 10.48,86.36 10.48,89.22 9.53,90.17 J5.7
  Bottom 0.254: v78.11,60.33 v78.11,34.29
PW_MOD
  Top 0.254: R18.P$2 162.56,64.14 161.93,64.77 145.73,64.77 142.88,61.91 132.08,61.91 129.22,64.77 50.16,64.77 47.41,67.53 36.3,67.53 35.24,68.58 35.24,70.8 34.29,71.75 26.04,71.75 11.11,86.68 11.11,89.53 9.21,91.44 5.08,91.44 J5.6
PW_POT  (via drill 0.6)
  Top 0.254: v32.7,52.07 34.61,50.16 71.12,50.16 v71.75,50.8 | v71.75,67.94 81.92,78.11 132.72,78.11 133.35,77.47 144.15,77.47 v144.78,76.83
  Bottom 0.254: v71.75,50.8 71.75,52.07 70.48,53.34 70.48,66.67 v71.75,67.94 | v144.78,76.83 J15.7 | J8.T 21.35,50.56 22.86,52.07 v32.7,52.07
RES_IN
  Top 0.254: R26.P$1 R26.P$2 | R26.P$1 58.07,88.55 | J16.3 45.72,85.09 45.72,88.9 46.35,89.53 57.15,89.53 58.13,88.55 R26.P$1
SUB  (via drill 0.6)
  Top 0.254: v111.76,67.94 112.39,67.31 119.38,67.31 121.28,69.22 130.18,69.22 133.13,72.17 145.2,72.17 148.27,75.25 v153.03,75.25
  Bottom 0.254: v153.03,75.25 152.4,75.88 J15.1 | R19.P$2 v111.76,67.94
V+
  Top 0.406: R25.P$1 83.82,88.59 83.82,90.17 85.09,91.44 132.08,91.44 | R23.P$1 160.06,90.13 158.75,91.44 146.05,91.44 139.92,97.57 134.4,97.57 132.08,95.25 132.08,91.44 | 132.08,91.44 132.08,87.31 133.03,86.36 J15.16
VCA_CV_IN  (via drill 0.6)
  Top 0.254: v20.64,52.7 19.37,51.44 2.54,51.44 1.27,52.7 1.27,75.56 1.91,76.2 v2.86,76.2 | 36.2,83.19 J16.11 34.92,81.92 25.4,81.92 24.77,82.55 v23.18,82.55
  Bottom 0.254: v20.64,52.7 21.27,53.34 21.27,57.7 J10.3 | v2.86,76.2 16.83,76.2 v23.18,82.55
VCA_IN
  Bottom 0.254: J16.9 40.64,85.09 40.64,87.63 41.27,88.27 41.91,88.27 43.5,89.85 43.5,93.98 41.91,95.57 40.96,95.57 SW10.P
VCC  (via drill 0.6)
  Top 0.61: R8.P$1 185.42,37.71 185.42,35.56 | 195.58,35.56 185.42,35.56 | 195.58,35.56 195.58,12.7 193.04,10.16 185.42,10.16 | 185.42,35.56 160.02,35.56 | 160.02,35.56 134.62,35.56 | R10.P$1 134.62,37.71 134.62,35.56 | R9.P$1 160.02,37.71 160.02,35.56 | 109.22,35.56 85.09,35.56 83.82,36.83 83.86,36.87 R12.P$1 | 134.62,35.56 109.22,35.56 | R11.P$1 109.22,37.71 109.22,35.56 | 83.82,60.96 160.02,60.96 | 83.82,60.96 82.55,60.96 81.28,62.23 65.41,62.23 64.14,60.96 58.42,60.96 | R20.P$1 83.82,63.11 83.82,60.96 | R18.P$1 160.02,63.11 160.02,60.96 | 195.58,35.56 195.58,50.8 185.42,60.96 | 160.02,60.96 185.42,60.96 | R17.P$1 185.42,63.11 185.42,60.96 | v47.62,62.55 56.2,62.55 57.78,60.96 58.42,60.96 | R21.P$1 58.42,63.11 58.42,60.96 | 185.42,10.16 160.02,10.16 | 160.02,10.16 134.62,10.16 | 134.62,10.16 109.22,10.16 | 109.22,10.16 85.09,10.16 83.86,11.39 R5.P$1 | R4.P$1 109.22,12.31 109.22,10.16 | R3.P$1 134.62,12.31 134.62,10.16 | R2.P$1 160.02,12.31 160.02,10.16 | R1.P$1 185.42,12.31 185.42,10.16 | v33.34,77.15 25.4,77.15 15.24,87.31 15.24,91.44 8.89,97.79 J5.1
  Bottom 0.61: v47.62,62.55 36.51,62.55 35.24,63.82 35.24,75.25 v33.34,77.15
VCF_CV_IN  (via drill 0.6)
  Top 0.254: v69.85,69.85 70.48,70.48 71.75,70.48 80.64,79.38 129.22,79.38 130.18,80.33 141.6,80.33 v141.92,80.01 | v69.85,46.99 65.72,42.86 51.44,42.86 46.04,37.47 v36.51,37.47
  Bottom 0.254: v69.85,46.99 69.85,48.26 69.22,48.9 69.22,69.22 v69.85,69.85 | J9.3 18.73,46.27 18.73,44.77 23.5,40.01 33.97,40.01 v36.51,37.47 | v141.92,80.01 142.24,80.33 J15.9
VCF_CV_OUT
  Top 0.254: J16.15 27.94,83.82 JP1.1
VCF_OUT
  Top 0.254: SW10.O 41.91,100.01 44.45,97.47 J16.6
  Bottom 0.254: J16.6 43.18,85.09 43.18,81.6 45.4,79.38 45.4,72.07 SW8.B2
VCF_OVERDRIVE
  Top 0.254: J16.12 36.83,87.95 39.37,90.49 SW10.S
VCO_CV_IN  (via drill 0.6)
  Top 0.254: v68.58,70.48 69.22,71.12 71.12,71.12 80.01,80.01 128.91,80.01 129.86,80.96 145.41,80.96 v146.05,80.33 | v25.4,38.1 26.35,39.05 37.15,39.05 37.78,38.42 45.72,38.42 51.12,43.81 65.09,43.81 68.58,47.31 v68.58,47.62
  Bottom 0.254: v68.58,47.62 v68.58,70.48 | v146.05,80.33 146.05,85.09 J15.6 | v25.4,38.1 22.23,34.92 J6.T
VCO_CV_OUT  (via drill 0.6)
  Top 0.254: v23.81,84.77 26.67,87.63 30.48,87.63 J16.16 | v1.27,77.47 0.64,76.83 0.64,51.44 v1.59,50.48 | v4.76,46.35 4.76,39.37 6.35,37.78 15.79,37.78 J7.T
  Bottom 0.254: v1.27,77.47 16.51,77.47 v23.81,84.77 | v1.59,50.48 4.76,47.31 v4.76,46.35
VCO_SYNC
  Top 0.254: SW9.P 137.16,93.98 140.97,90.17 140.97,85.72 140.34,85.09 138.43,85.09 J15.13
VEE  (via drill 0.6)
  Top 0.406: R23.P$3 165.1,88.59 165.1,90.17 162.56,92.71 149.86,92.71 140.02,102.55 133.35,102.55 130.81,100.01 v130.81,96.52 127,92.71 89.53,92.71 v88.9,93.34 | J15.12 139.7,87 138.75,87.95 134.3,87.95 133.35,88.9 v133.35,93.98
  Bottom 0.406: v88.9,93.34 88.86,93.31 R25.P$3 | v130.81,96.52 v133.35,93.98
VOL_IN  (via drill 0.6)
  Top 0.254: R27.P$1 17.78,88.51 17.78,87.63 18.41,87 24.77,87 26.99,89.22 31.75,89.22 33.02,87.95 33.02,85.09 J16.13 34.29,84.45 33.66,83.82 | v11.11,71.75 v11.11,79.06
  Bottom 0.254: J13.3 18.65,71.2 18.1,71.75 v11.11,71.75 | v11.11,79.06 11.11,81.84 R27.P$1
VOL_OUT
  Top 0.254: J16.14 34.29,88.9 32.38,90.81 21.59,90.81 20.32,89.53 R27.P$2

### Text on the board
bPlace: ANOOKUM | ANALOG MONOSYNTH ALSO KNOWN AS ANUSHRI | cc-by-sa, Olivier Gillet, 2012. rev. C | WWW.SKOOKUMSYNTH.COM | used under license, alternate parts
bNames: Volume | Fuzz | Resonance | Mix | Sync | PW | FM | A | A | CD | >VCF CV | Mode | LFO mod | Env mod | Sub level | Sub | PW mod | VCO mod | CD | CD | 4 | 3 | 2 | 1 | 10 | 9 | 8 | 7 | 6